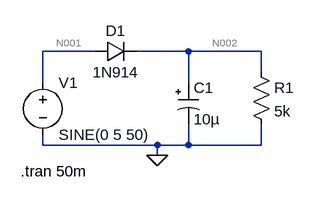
[diagram p0: schematic Draft1.asc]
Draft1.asc, the LTspice schematic file:
Version 4
SHEET 1 880 680
WIRE 224 16 144 16
WIRE 368 16 288 16
WIRE 480 16 368 16
WIRE 480 48 480 16
WIRE 144 64 144 16
WIRE 368 64 368 16
WIRE 144 160 144 144
WIRE 320 160 144 160
WIRE 368 160 368 128
WIRE 368 160 320 160
WIRE 480 160 480 128
WIRE 480 160 368 160
WIRE 320 176 320 160
FLAG 320 176 0
SYMBOL voltage 144 48 R0
WINDOW 123 0 0 Left 0
WINDOW 39 0 0 Left 0
SYMATTR InstName V1
SYMATTR Value SINE(0 5 50)
SYMBOL diode 224 32 R270
WINDOW 0 32 32 VTop 2
WINDOW 3 0 32 VBottom 2
SYMATTR InstName D1
SYMATTR Value 1N914
SYMBOL polcap 352 64 R0
WINDOW 3 24 56 Left 2
SYMATTR InstName C1
SYMATTR Value 10µ
SYMATTR Description Capacitor
SYMATTR Type cap
SYMATTR SpiceLine V=6.3 Irms=0 Rser=4 Lser=0 mfg="AVX" pn="TAJA106M006" type="Tantalum"
SYMBOL res 464 32 R0
SYMATTR InstName R1
SYMATTR Value 5k
TEXT 110 200 Left 2 !.tran 50m

The netlist it stands for:
* Draft1.asc
V1 N001 0 SINE(0 5 50)
D1 N001 N002 1N914
C1 N002 0 10µ V=6.3 Irms=0 Rser=4 Lser=0 mfg="AVX" pn="TAJA106M006" type="Tantalum"
R1 N002 0 5k
.model D D
.lib standard.dio
.tran 50m
.backanno
.end

* Results of the author's LTspice run, read from the files saved beside the schematic
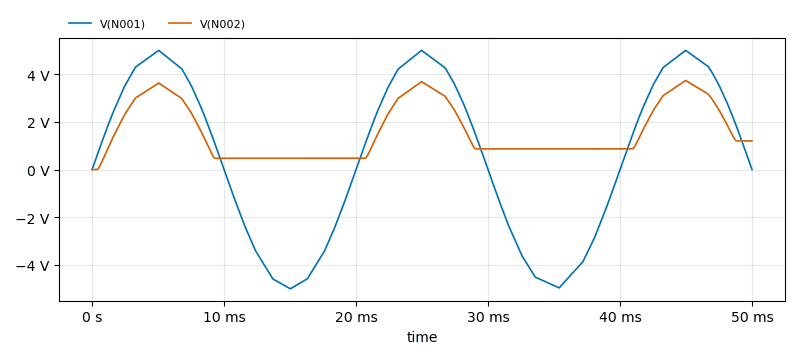
[diagram p1: Transient Analysis of Draft1.asc, plotted from the saved traces]
* Transient Analysis, 1 run:
*   V(N001): min -5 V, max 4.997 V, average 626.9 mV, rms 3.489 V, last 0 V
*   V(N002): min 0 V, max 3.735 V, average 1.597 V, rms 1.969 V, last 1.2 V